# Altium schematic sheet ADJ_REG.SchDoc
size A; SheetNumber: 4; SheetTotal: 4
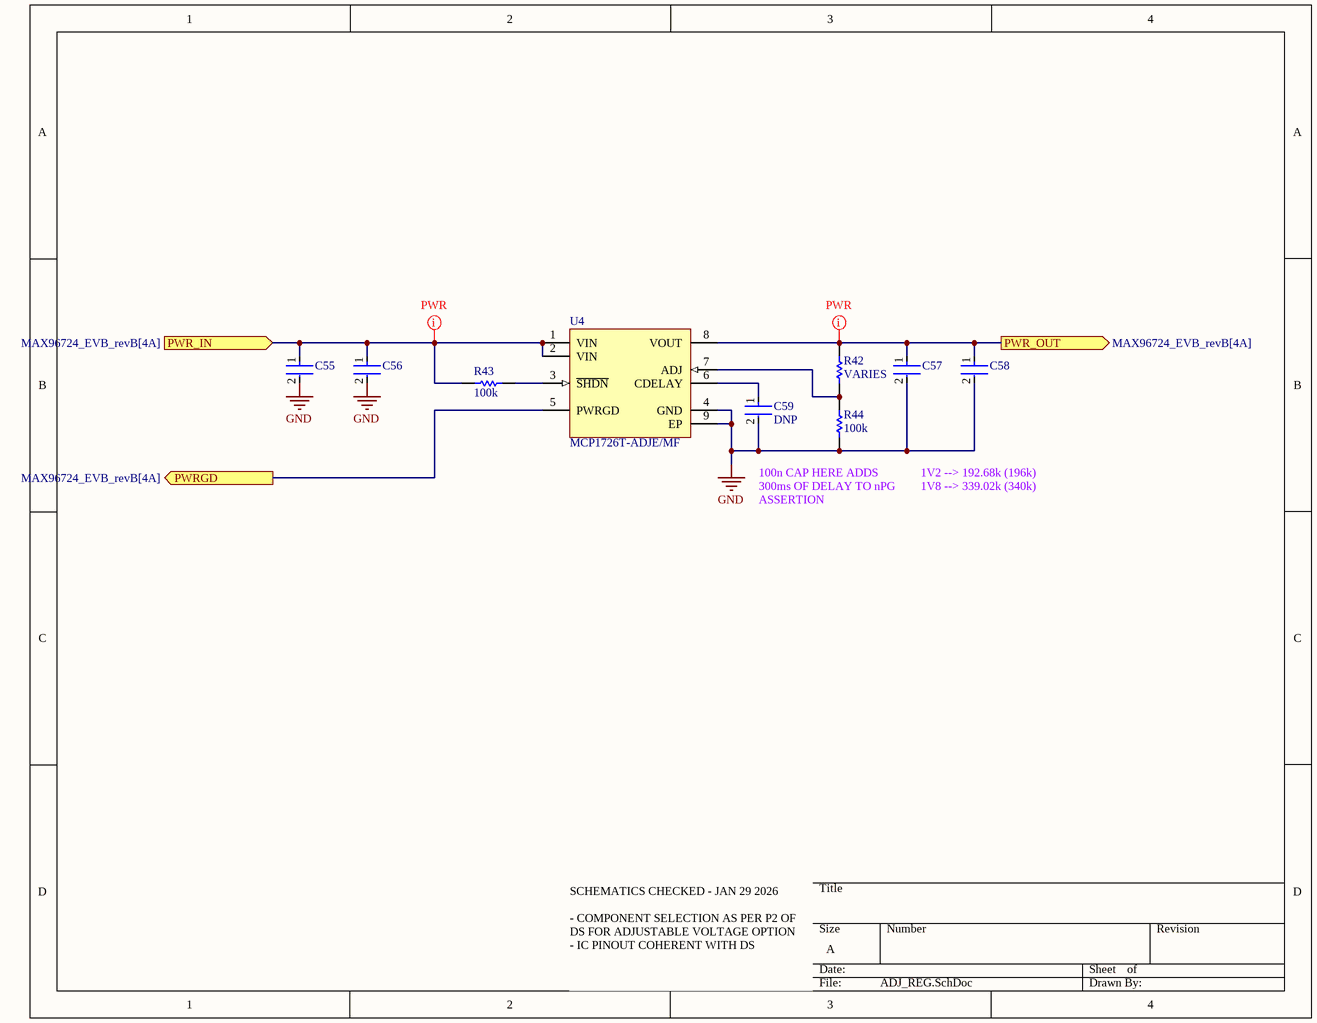
[diagram p0: ADJ_REG.SchDoc]

## Parts
C55  C0805C475J4RACAUTO  [FP-C0805C475J4RACAUTO-MFG]  (value not drawn)
C56  DNP  [FP-C0805C475J4RACAUTO-MFG]  (value not drawn)
C57  HMK325B7105KN-T  [FP-1210-L_3_2_0_3-W_2_5_0-IPC_B]  (value not drawn)
C58  DNP  [FP-1210-L_3_2_0_3-W_2_5_0-IPC_B]  (value not drawn)
C59  DNP  [FP-0402-L_1_0_0_05-W_0_5-IPC_A]
R42  VARIES  [R0603B]
R43  100k  [R0603B]
R44  100k  [R0603B]
U4  MCP1726T-ADJE/MF  [DFN-MF8]

## Ports
PWR_IN (in, see MAX96724_EVB_revB[4A]), PWR_OUT (out, see MAX96724_EVB_revB[4A]), PWRGD (out, see MAX96724_EVB_revB[4A])

## Nets
GND: C55.2 C56.2 C57.2 C58.2 C59.2 R44.1 U4.4(GND) U4.9(EP)
PWR_IN: C55.1 C56.1 R43.1 U4.1(VIN) U4.2(VIN) ; port PWR_IN
PWR_OUT: C57.1 C58.1 R42.2 U4.8(VOUT) ; port PWR_OUT
PWRGD: U4.5(PWRGD) ; port PWRGD
NetC59_1: C59.1 U4.6(CDELAY)
NetR42_1: R42.1 R44.2 U4.7(ADJ)
NetR43_2: R43.2 U4.3(~{SHDN})

## Layout directives
net class PWR: PWR_IN, PWR_OUT

## Notes on the sheet
- (near R44) 100n CAP HERE ADDS 300ms OF DELAY TO nPG ASSERTION
- 1V2 --> 192.68k (196k)
  1V8 --> 339.02k (340k)
- SCHEMATICS CHECKED - JAN 29 2026
  - COMPONENT SELECTION AS PER P2 OF DS FOR ADJUSTABLE VOLTAGE OPTION
  - IC PINOUT COHERENT WITH DS

## Library data of the parts
C55 C56 = CMP-00212-84766729-1: C0805C475J4RACAUTO Cap Ceramic 4.7uF 16V X7R 5% Pad SMD 0805 125C Automotive T/R; Capacitance: 4.7µF; Max Operating Temperature: 125°C; Dielectric Material: Ceramic; Voltage Rating (DC): 16V; Dielectric: X7R; Height: 1.4mm; Case/Package: 0805; NexarPartId: 84766729; Voltage Rating: 16V; RoHS: Compliant; Material: Ceramic; Packaging: Cut Tape; Tolerance: 5%; Min Operating Temperature: -55°C
C57 C58 = CMP-14477-002774-2: None; Dielectric: X5R; Capacitance: 1uF; Voltage Rating (DC): 100V; Tolerance: 10%; Length: 3.2mm; Thickness: 0.083inch; Construction: Flat; Width: 2.5mm; Number of Pins: 2; Height: 1.9mm; REACH SVHC: No SVHC; Case Code (Metric): 3225; Termination: SMD/SMT; Packaging: Tape and Reel; Resistor Type: Ceramic; Mount: Surface Mount; Radiation Hardening: No; Case/Package: 1210; Case Code (Imperial): 1210; Min Operating Temperature: -55°C; Max Operating Temperature: 125°C; Halogen Free: Halogen Free; Voltage Rating: 100V; Depth: 2.5mm; Package Quantity: 1; RoHS Compliant: Yes; Voltage: 100V; Series: M
C59 = CMP-001-00058-1: LARGE PADS, 0402 CAP, CHANGE COMMENT TO MATCH REAL P/N; Capacitor Type: Ceramic; Min Operating Temperature: -55°C; Mounting Technology: Surface Mount; Pins: 2; Case/Package: 0402; RoHS Compliant: Yes; Max Operating Temperature: 85°C
R42 R43 = CMP-009-00002-14: Resistor
  R42: Value: VARIES
  R43: Value: 100k
R44 = CMP-009-00002-14: Resistor; Value: 10k
U4 = CMP-0136-00358-1: 1A, Low Voltage, Low Quiescent Current LDO Regulator, 8-Pin DFN, Extended Temperature, Tape and Reel; DatasheetVersion: revC, Aug-2007; PackageDescription: 8-Lead Plastic Dual Flat, No Lead Package (MF) - 3x3x0.9mm Body [DFN]; PackageVersion: revBB, Aug-2009; PackageReference: DFN-MF8